# EAGLE design 8P8C-to-6P6C (EAGLE 7.7.0)
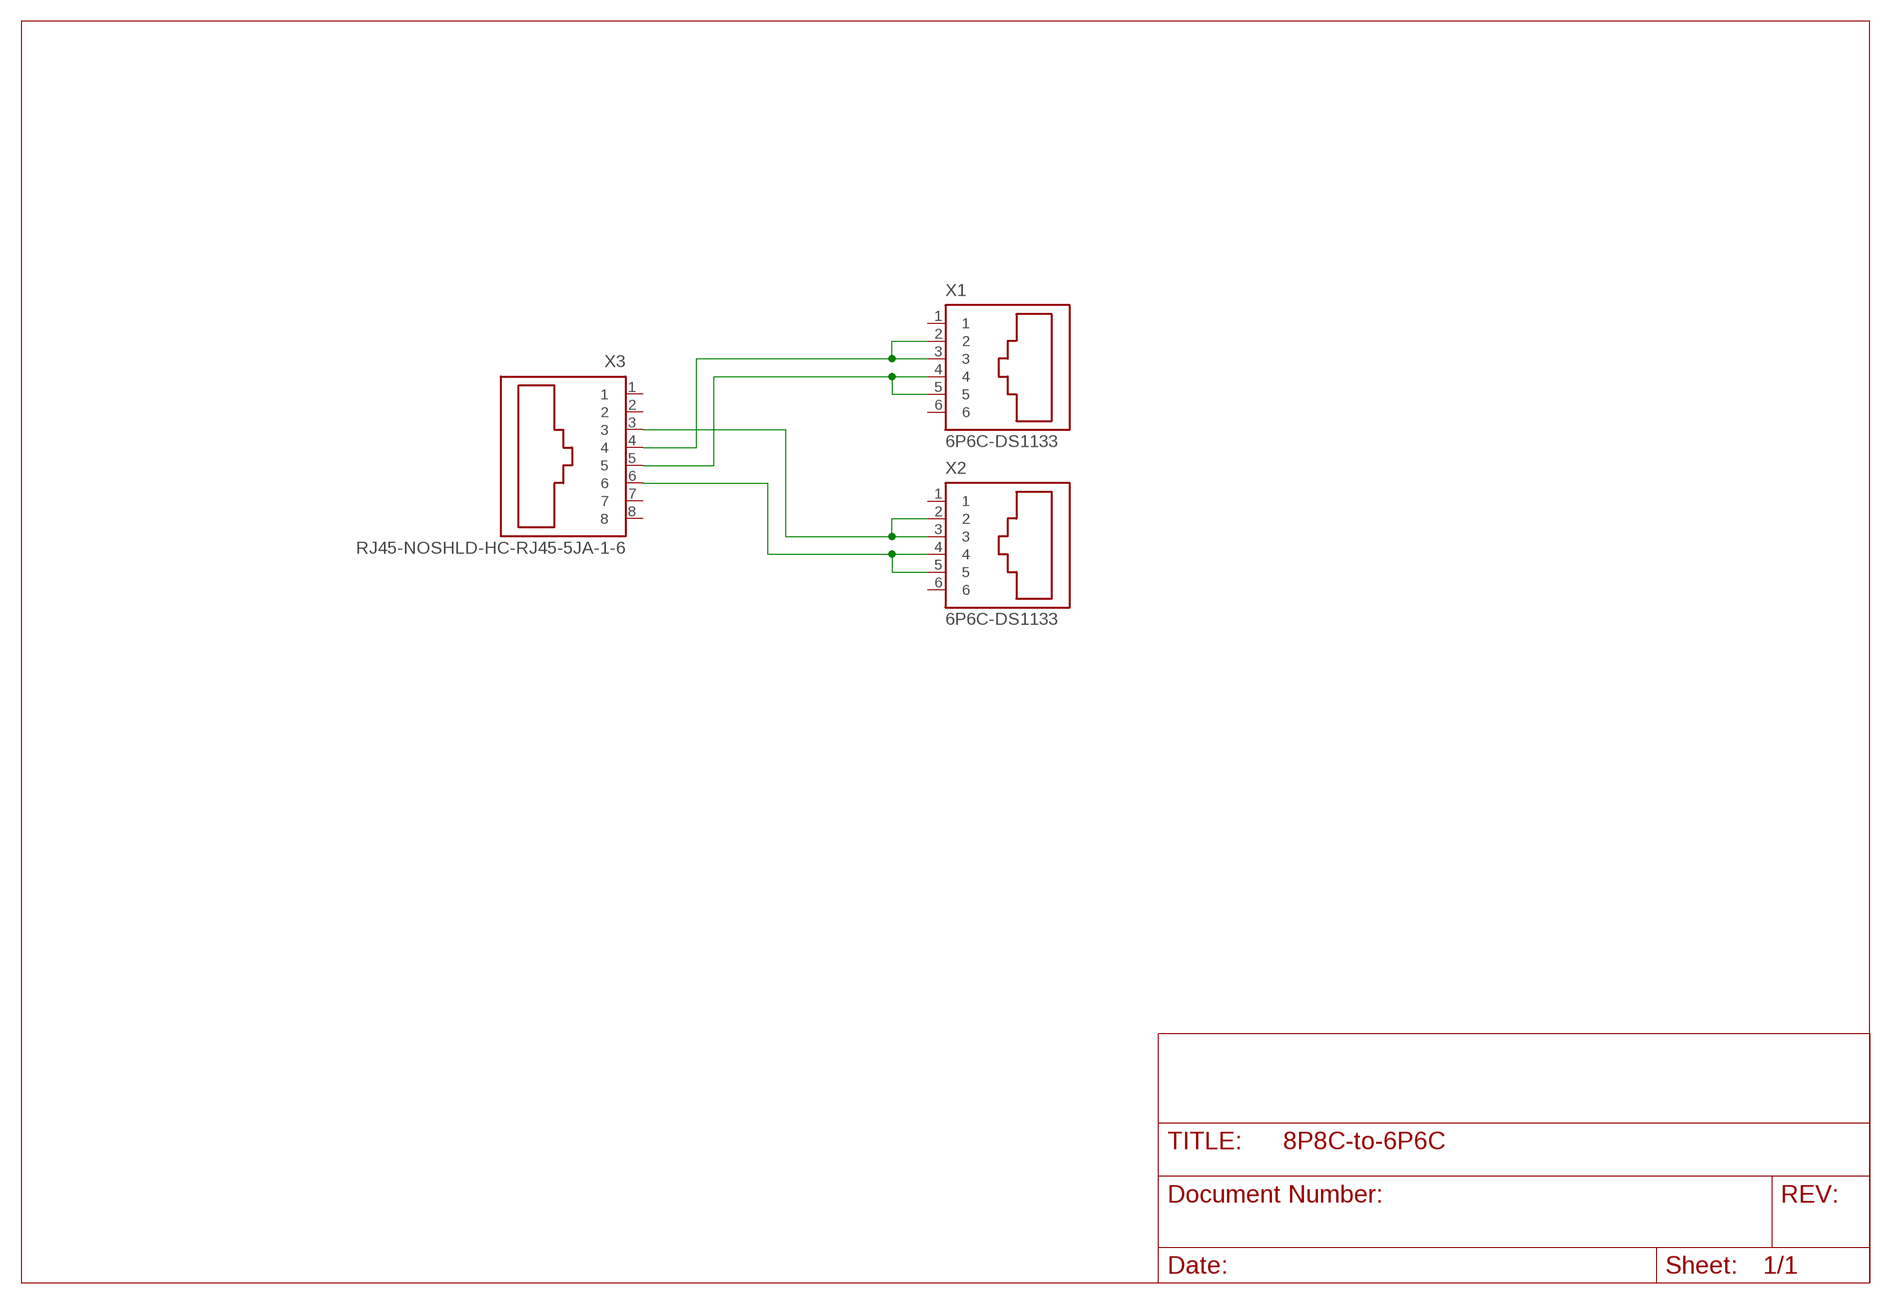
[diagram p0: schematic, sheet 1]

## Parts
X1  6P6C-DS1133  [DS1133]
X2  6P6C-DS1133  [DS1133]
X3  RJ45-NOSHLD-HC-RJ45-5JA-1-6  [HC-RJ45-5JA-1-6]

## Nets
N$1: X1.2 X1.3 X3.4
N$2: X1.4 X1.5 X3.5
N$3: X2.2 X2.3 X3.3
N$4: X2.4 X2.5 X3.6
Unconnected: X1.1 X1.6 X2.1 X2.6 X3.1 X3.2 X3.7 X3.8

## Library data of the parts
X1 X2 = stewart-rj45:6P6C
X3 = stewart-rj45:RJ45-NOSHLD

## Board
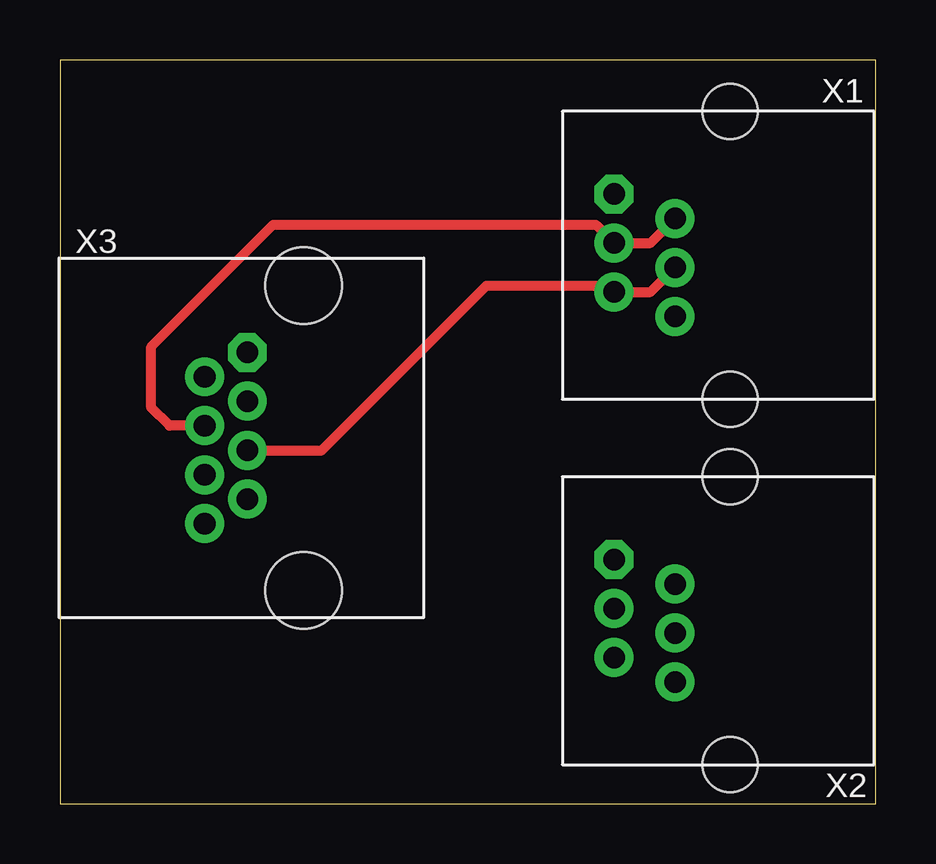
[diagram p1: board, top side]
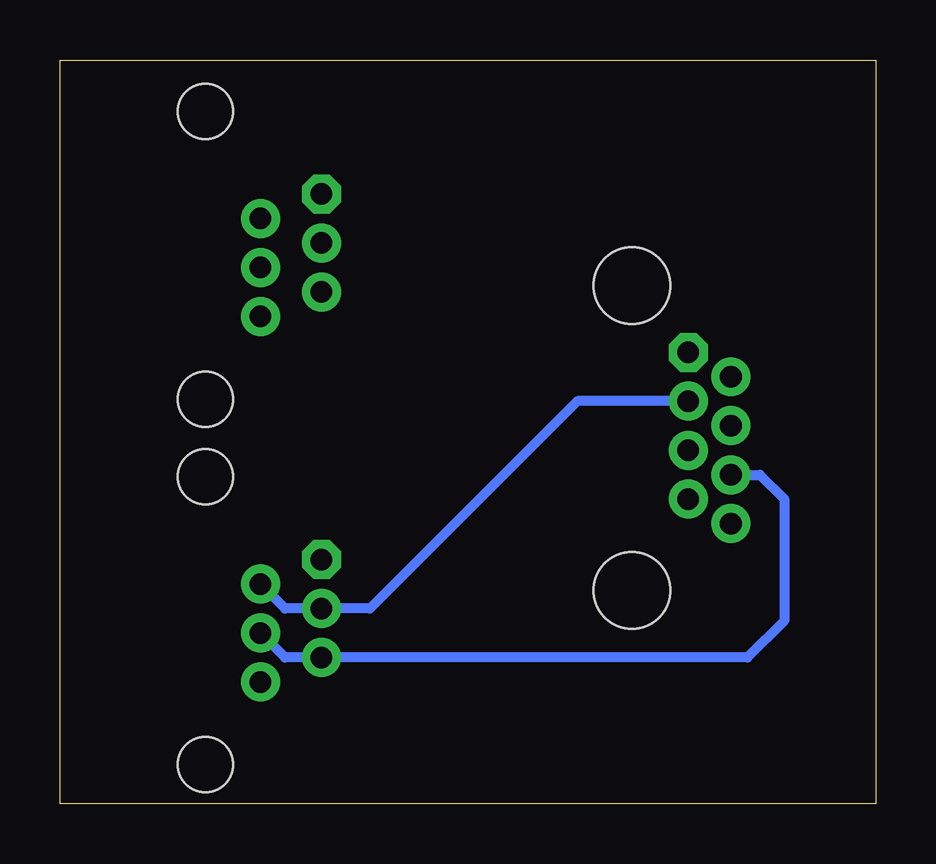
[diagram p2: board, bottom side, seen from below]

Size 34 x 31 mm. Coordinates in mm from the lower left corner, seen from the top.
Outline: 0,0 34,0 34,31 0,31 0,0
Copper layers (1*16): Top 0.035mm / dielectric 1.6mm / Bottom 0.035mm
Design rules "jlcpcb-2layers": minimum track width 5mil, minimum drill 0.3mm, track to track 5mil, track to pad 5mil, pad to pad 5mil, via to via 5mil, smd to smd 5mil, copper to edge 0.2mm, drill to drill 6mil, minimum pad ring 10mil, minimum via ring 3mil, stop-mask expansion 4mil, vias tented up to drill 0mil, thermal gap 10mil

### Footprints (pad centres in the part's own frame; a part is rotated, then mirrored left to right if it is on the bottom)
DS1133 = drill 0.9 octagon: 1 2.55,4.84 | drill 0.9: 2 1.53,2.3; 3 0.51,4.84; 4 -0.51,2.3; 5 -1.53,4.84; 6 -2.55,2.3 | hole 2.3: -6,0; 6,0
HC-RJ45-5JA-1-6 = drill 0.9 pad 1.5 octagon: 1 3.57,2.35 | drill 0.9 pad 1.5: 2 2.55,4.13; 3 1.535,2.35; 4 0.515,4.13; 5 -0.515,2.35; 6 -1.535,4.13; 7 -2.55,2.35; 8 -3.57,4.13 | hole 3.2: -6.35,0; 6.35,0

### Placement (x,y rotation side)
X1  27.94,22.86 90 top
X2  27.94,7.62 90 top
X3  10.16,15.24 90 top

### Tracks (layer width: path | path; a pad name or v marks a point on that pad's centre or on a via)
N$1
  Top 0.406: X3.4 4.57,15.76 3.81,16.51 3.81,19.05 8.89,24.13 22.34,24.13 X1.3 24.62,23.37 X1.2
N$2
  Top 0.406: X3.5 10.91,14.72 17.78,21.59 22.84,21.59 X1.5 24.62,21.33 X1.4
N$3
  Bottom 0.406: X3.3 12.44,16.77 21.08,8.13 X2.3 24.62,8.13 X2.2
N$4
  Bottom 0.406: X3.6 4.82,13.71 3.81,12.7 3.81,7.62 5.34,6.09 X2.5 24.62,6.09 X2.4

### Text on the board
tDocu: 8P8C - 6P4C / (C) 2025 CC-BY-SA / retronetworking.org | 1 (inner) | EKSOS | 2 (outer)